# EAGLE design Qwiic-Bluetooth-HC1X (EAGLE 9.0.1)
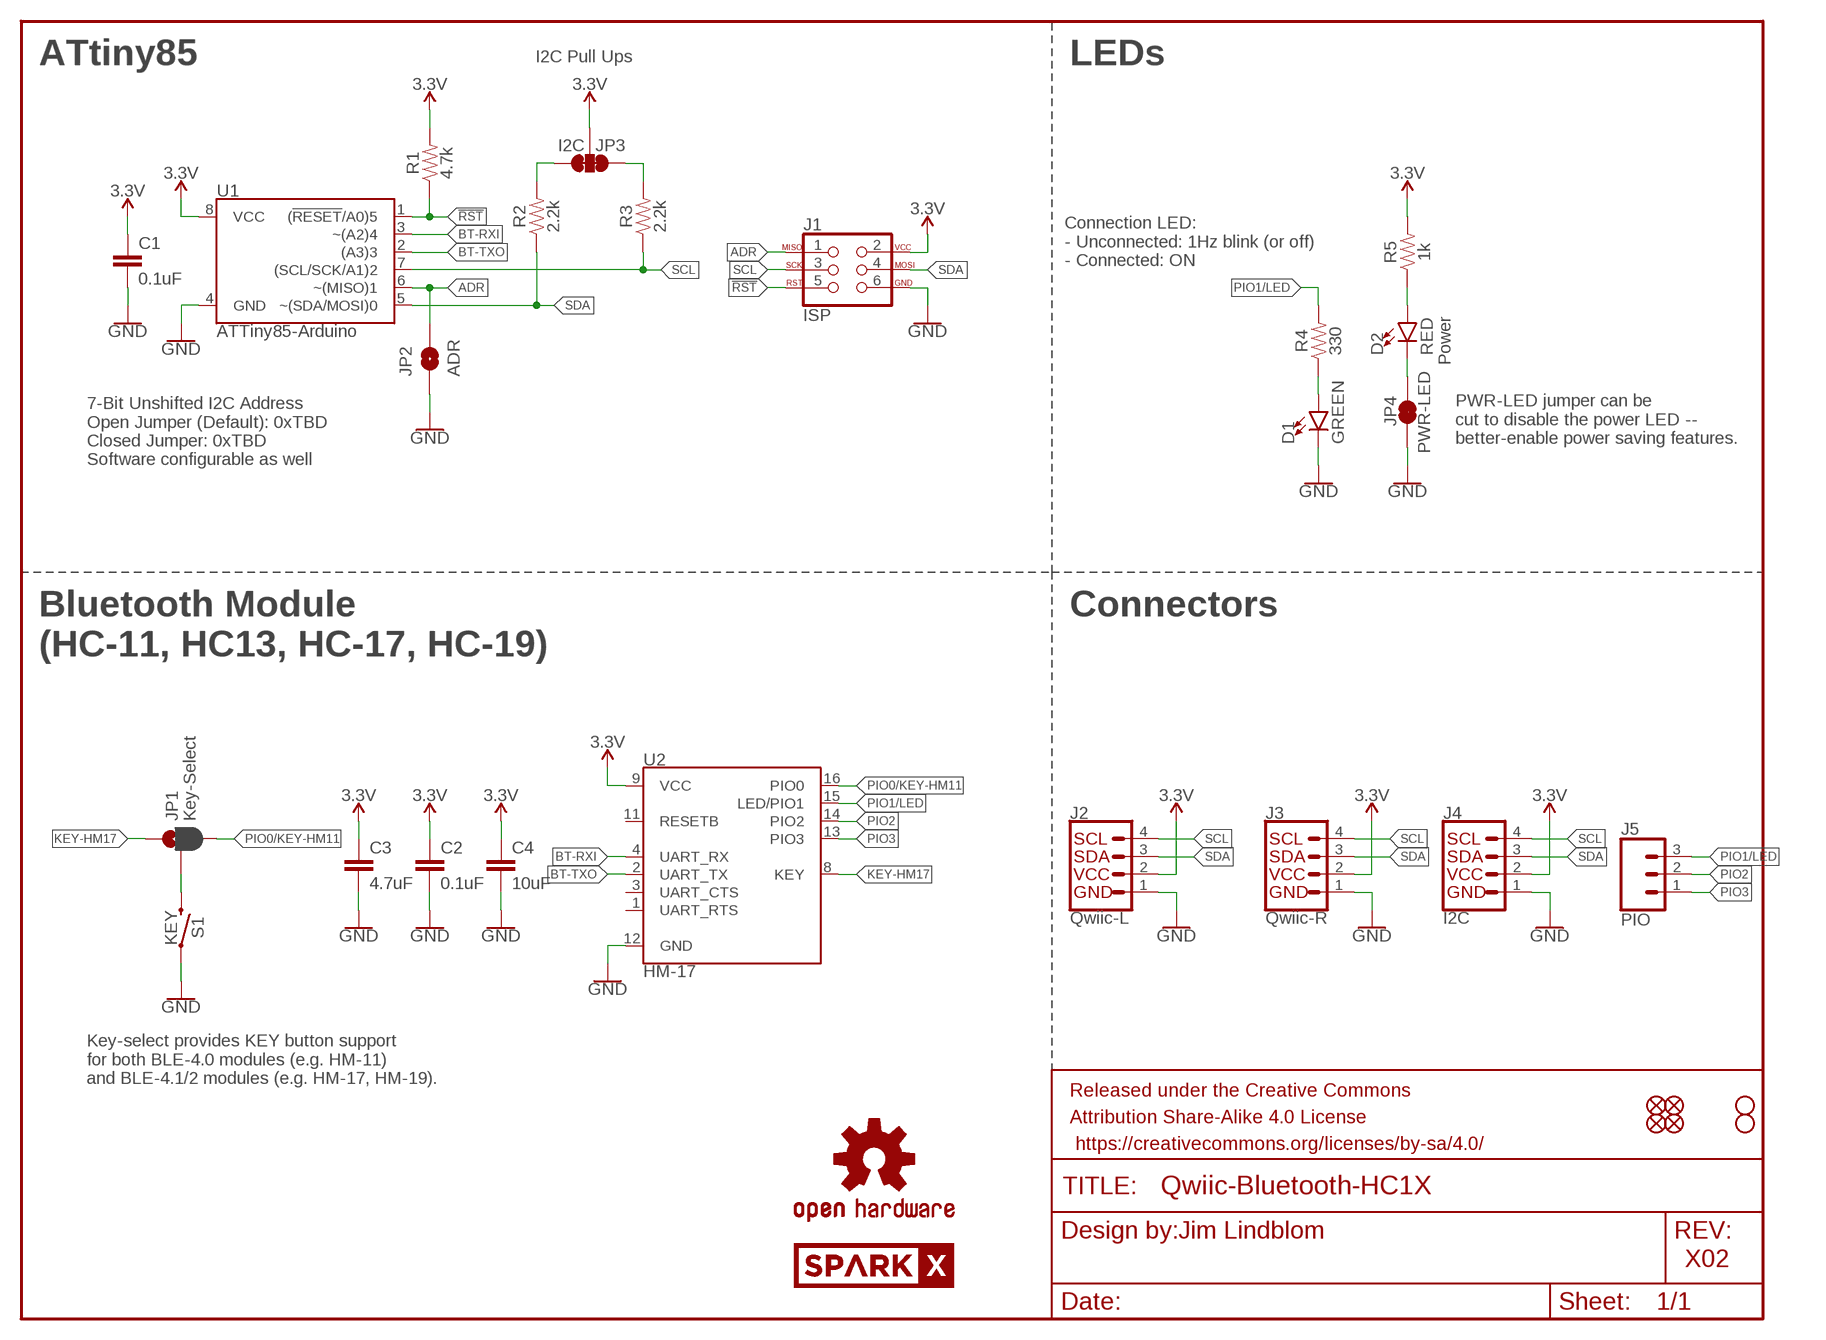
[diagram p0: schematic, sheet 1]

## Parts
C1  0.1uF  0.1UF-0603-25V-(+80/-20%)  [0603]
C2  0.1uF  0.1UF-0603-25V-(+80/-20%)  [0603]
C3  4.7uF  4.7UF-0603-6.3V-(10%)  [0603]
C4  10uF  10UF-0603-6.3V-20%  [0603]
D1  GREEN  LED-GREEN0603  [LED-0603]
D2  RED  LED-RED0603  [LED-0603]
FRAME1  FRAME-LETTER  [CREATIVE_COMMONS]
J1  ISP  AVR_SPI_PROG_3X2TESTPOINTS  [2X3_TEST_POINTS]
J2  Qwiic-L  QWIIC_CONNECTORJS-1MM  [1X04_1MM_RA]
J3  Qwiic-R  QWIIC_CONNECTORJS-1MM  [1X04_1MM_RA]
J4  I2C  I2C_STANDARD_NO_SILK  [1X04_NO_SILK]
J5  PIO  CONN_031X03_NO_SILK  [1X03_NO_SILK]
JP1  Key-Select  JUMPER-SMT_3_1-NC_PASTE_NO-SILK  [SMT-JUMPER_3_1-NC_PASTE_NO-SILK]
JP2  ADR  JUMPER-SMT_2_NO_NO-SILK  [SMT-JUMPER_2_NO_NO-SILK]
JP3  I2C  JUMPER-SMT_3_2-NC_TRACE_NO-SILK  [SMT-JUMPER_3_2-NC_TRACE_NO-SILK]
JP4  PWR-LED  JUMPER-SMT_2_NC_TRACE_NO-SILK  [SMT-JUMPER_2_NC_TRACE_NO-SILK]
JP5  FIDUCIALUFIDUCIAL  [FIDUCIAL-MICRO]
JP6  FIDUCIALUFIDUCIAL  [FIDUCIAL-MICRO]
JP7  FIDUCIALUFIDUCIAL  [FIDUCIAL-MICRO]
JP8  FIDUCIALUFIDUCIAL  [FIDUCIAL-MICRO]
JP11  STAND-OFF  [STAND-OFF]
JP12  STAND-OFF  [STAND-OFF]
LOGO1  OSHW-LOGOMINI  [OSHW-LOGO-MINI]
LOGO2  SPARKX-LOGO4  [SPARKX-MEDIUM]
LOGO3  SPARKX-LOGO4  [SPARKX-MEDIUM]
R1  4.7k  4.7KOHM-0603-1/10W-1%  [0603]
R2  2.2k  2.2KOHM-0603-1/10W-1%  [0603]
R3  2.2k  2.2KOHM-0603-1/10W-1%  [0603]
R4  330  330OHM-0603-1/10W-1%  [0603]
R5  1k  1KOHM-0603-1/10W-1%  [0603]
S1  KEY  MOMENTARY-SWITCH-SPST-SMD-4.6X2.8MM  [TACTILE_SWITCH_SMD_4.6X2.8MM]
U1  ATTiny85-Arduino  ATTINY85-ARDUINOTINY85-20-SMT  [SO08-EIAJ_MCU]
U2  HM-17  [HM-11]

## Nets
3.3V: C1.1 C2.1 C3.1 C4.1 J1.2 J2.2 J3.2 J4.2(VCC) JP3.2 R1.2 R5.2 U1.8(VCC) U2.9(VCC)
!RST: J1.5 R1.1 U1.1((!RESET!/A0)5)
ADR: J1.1 JP2.2 U1.6(~(MISO)1)
BT-RXI: U1.3(~(A2)4) U2.4(UART_RX)
BT-TXO: U1.2((A3)3) U2.2(UART_TX)
GND: C1.2 C2.2 C3.2 C4.2 D1.C J1.6 J2.1 J3.1 J4.1(GND) JP2.1 JP4.1 S1.1 S1.2 U1.4(GND) U2.12(GND)
KEY-HM17: JP1.1 U2.8(KEY)
N$1: D2.C JP4.2
N$2: D1.A R4.1
N$3: D2.A R5.1
N$4: JP1.2 S1.3 S1.4
PIO0/KEY-HM11: JP1.3 U2.16(PIO0)
PIO1/LED: J5.3 R4.2 U2.15(LED/PIO1)
PIO2: J5.2 U2.14(PIO2)
PIO3: J5.1 U2.13(PIO3)
SCL: J1.3 J2.4 J3.4 J4.4(SCL) R3.1 U1.7((SCL/SCK/A1)2)
SCL_PU1: JP3.1 R3.2
SDA: J1.4 J2.3 J3.3 J4.3(SDA) R2.1 U1.5(~(SDA/MOSI)0)
SDA_PU1: JP3.3 R2.2
Unconnected: U2.1(UART_RTS) U2.3(UART_CTS) U2.11(RESETB)

## Notes on the sheet
- ATtiny85 | LEDs
- I2C Pull Ups
- Connection LED:
  - Unconnected: 1Hz blink (or off)
  - Connected: ON
- Power
- PWR-LED jumper can be 
  cut to disable the power LED -- 
  better-enable power saving features.
- 7-Bit Unshifted I2C Address
  Open Jumper (Default): 0xTBD
  Closed Jumper: 0xTBD
  Software configurable as well
- Bluetooth Module
  (HC-11, HC13, HC-17, HC-19)
- Connectors
- Key-select provides KEY button support 
  for both BLE-4.0 modules (e.g. HM-11) 
  and BLE-4.1/2 modules (e.g. HM-17, HM-19).
- Jim Lindblom
- X02

## Library data of the parts
C1 C2 = SparkFun-Capacitors:0.1UF: 0.1µF ceramic capacitors A capacitor is a passive two-terminal electrical component used to store electrical energy temporarily in an electric field.; PROD_ID: CAP-00810
C3 = SparkFun-Capacitors:4.7UF: 4.7µF ceramic capacitors A capacitor is a passive two-terminal electrical component used to store electrical energy temporarily in an electric field.; PROD_ID: CAP-08280
C4 = SparkFun-Capacitors:10UF: 10.0µF ceramic capacitors A capacitor is a passive two-terminal electrical component used to store electrical energy temporarily in an electric field.; PROD_ID: CAP-11015
D1 = SparkFun-LED:LED-GREEN: Green SMD LED Used in manufacturing of various products at SparkFun Packages: 0603 - SMD 0603 package [Product Link] <http://www.futureelectronics.com/en/technologies/semiconductors/optoelectronics/leds/Pages/9894312-LTST-C190GKT.aspx?CrossPart=HSMG-C190&IM=0> LilyPad 1206 - SMD1206 LilyPad package [Product Link] <http://www.futureelectronics.com/en/Technologies/Product.aspx?ProductID=IN150NGHARVATEKCORPORATION2049943&IM=0> 1206 - SMD1206 package [Product Link] <http://www.futureelectronics.com/en/technologies/semiconductors/optoelectronics/leds/Pages/8315665-LTST-C150KGKT.aspx?IM=0> 1206 Bottom Mount -SMD 1206 Bottom Mount [Product Link] <http://www.digikey.com/product-detail/en/lite-on-inc/LTST-C230KGKT/160-1456-1-ND/386854> SparkFun Products: Pro Mini 328 -5V <https://www.sparkfun.com/products/821> RedBoard <https://www.sparkfun.com/products/12757> MP3 Trigger <https://www.sparkfun.com/products/13720> Makey Makey <https://www.sparkfun.com/products/11076>; PROD_ID: DIO-00821
D2 = SparkFun-LED:LED-RED: Red SMD LED Used in manufacturing of most products at SparkFun Packages: 0603 - SMD 0603 package [Product Link] <http://docs.avagotech.com/docs/AV02-0551EN> 0603 SMART - SMD 0603 SMART package ( more efficient and expensive)[Product Link] <http://www.osram-os.com/Graphics/XPic2/00077099_0.pdf> 1206 - SMD1206 package [Product Link] <https://www.sparkfun.com/datasheets/DevTools/LilyPad/Q150OVS4.pdff> SparkFun Products: Pro Mini 328 -5V <https://www.sparkfun.com/products/821> RedBoard <https://www.sparkfun.com/products/12757> IOIO-OTG <https://www.sparkfun.com/products/13613>; PROD_ID: DIO-00819
FRAME1 = SparkFun-Aesthetics:FRAME-LETTER: Schematic Frame - Letter Standard 8.5x11 US Letter frame
J1 = SparkFun-Connectors:AVR_SPI_PROG_3X2: AVR ISP 6 Pin This is the reduced ISP connector for AVR programming. Common on Arduino. This footprint will take up less PCB space and can be used with a 10-pin to 6-pin adapter such as SKU: BOB-08508 **Special note about "TEST_POINT" package. The stop mask is on the top side, so if you want your programming test points to be on the bottom of your board, make sure to place this package on the bottom side of the board. This also ensure that the orientation to program from the bottom side will be correct. SparkFun Products: SparkFun ISP Pogo Adapter <https://www.sparkfun.com/products/11591> - NS Tiny AVR Programmer <https://www.sparkfun.com/products/11801> -PTH
J2 J3 = SparkFun-Connectors:QWIIC_CONNECTOR: SparkFun I2C Standard Qwiic Connector An SMD 1mm pitch JST connector makes it easy and quick (get it? Qwiic?) to connect I2C devices to each other. The Qwiic system <http://www.sparkfun.com/qwiic> enables fast and solderless connection between popular platforms and various sensors and actuators. We carry 200mm <https://www.sparkfun.com/products/14204>, 100mm <https://www.sparkfun.com/products/14205>, 50mm <https://www.sparkfun.com/products/14206>, and breadboard friendly <https://www.sparkfun.com/products/14207> Qwiic cables. We also offer 10 pcs strips <https://www.sparkfun.com/products/14323> the SMD connectors.; PROD_ID: CONN-13694
J4 = SparkX:I2C_STANDARD: SparkFun I2C Standard Pinout Header SparkFun has standardized on a pinout for all I2C based sensor breakouts. This pinout allows I2C boards to be plugged directly into the headers on Arduino Uno compatible boards, and to be daisy chained easily. Example SparkFun Products: SparkFun Atmospheric Sensor Breakout - BME280 <https://www.sparkfun.com/products/13676> SparkFun Altitude/Pressure Sensor Breakout - MPL3115A2 <https://www.sparkfun.com/products/11084> SparkFun TOF Range Finder Sensor - VL6180 <https://www.sparkfun.com/products/12785>
J5 = SparkFun-Connectors:CONN_03: Multi connection point. Often used as Generic Header-pin footprint for 0.1 inch spaced/style header connections On any of the 0.1 inch spaced packages, you can populate with these: Break Away Headers - Straight <https://www.sparkfun.com/products/116> (PRT-00116) Break Away Male Headers - Right Angle <https://www.sparkfun.com/products/553> (PRT-00553) Female Headers <https://www.sparkfun.com/products/115> (PRT-00115) Break Away Headers - Machine Pin <https://www.sparkfun.com/products/117> (PRT-00117) Break Away Female Headers - Swiss Machine Pin <https://www.sparkfun.com/products/743> (PRT-00743) Stackable Header - 3 Pin (Female, 0.1") <https://www.sparkfun.com/products/13875> (PRT-13875) For SCREWTERMINALS and SPRING TERMINALS visit here: Screw Terimnals on SparkFun.com <https://www.sparkfun.com/search/results?term=Screw+Terminals> (5mm/3.5mm/2.54mm spacing) This device is also useful as a general connection point to wire up your design to another part of your project. Our various solder wires solder well into these plated through hole pads. Hook-Up Wire - Assortment (Stranded, 22 AWG) <https://www.sparkfun.com/products/11375> (PRT-11375) Hook-Up Wire - Assortment (Solid Core, 22 AWG) <https://www.sparkfun.com/products/11367> (PRT-11367) View the entire wire category on our website here <https://www.sparkfun.com/categories/141> Special notes: Molex polarized connector foot print use with SKU : PRT-08232 with associated crimp pins and housings.
JP1 = SparkFun-Jumpers:JUMPER-SMT_3_1-NC_PASTE: Normally closed solder jumper (1 of 2 connections) This jumper has an aperture in the stencil to allow solder paste to bridge one of the two connections. One connection is normally closed (NC), while the other is normally open (NO). Wick off the solder to open the connection. Reapply solder to reclose the connection. Apply solder to the other side instead to change the current path.
JP2 = SparkFun-Jumpers:JUMPER-SMT_2_NO: Normally open jumper This jumper has two pads in close proximity to each other. Apply solder to close the connection. Round pads are easier to solder for beginners, but are a lot larger. SparkFun Product that uses the round pads: SparkFun EL Sequencer <https://www.sparkfun.com/products/12781>
JP3 = SparkFun-Jumpers:JUMPER-SMT_3_2-NC_TRACE: Normally closed trace jumper (2 of 2 connections) This jumper has a trace between all three pads so they are normally closed (NC). Use a razor knife to open the connection(s). For best results follow the IPC guidelines for cutting traces: Cutout at least 0.063 mm (0.005 in). Remove all loose material to clean up the cut area. Seal the cut with an approved epoxy. Reapply solder to reclose the connection(s).
JP4 = SparkFun-Jumpers:JUMPER-SMT_2_NC_TRACE: Normally closed trace jumper This jumper has a trace between two pads so it's normally closed (NC). Use a razor knife to open the connection. For best results follow the IPC guidelines for cutting traces: Cutout at least 0.063 mm (0.005 in). Remove all loose material to clean up the cut area. Seal the cut with an approved epoxy. Reapply solder to reclose the connection.
JP5-JP8 = SparkFun-Aesthetics:FIDUCIAL: Fiducial Alignment Points Point-of-reference for pick-and-place machines and other optical instruments.
JP11 JP12 = SparkFun-Hardware:STAND-OFF: Stand Off Drill holes for mechanically mounting via screws, standoffs, etc. Note: Use the keepout ring to avoid running the screw head into surrounding components. Variant Overviews STAND-OFF - Mechanical footprint for a #4 phillips button head screw. STAND-OFF-TIGHT - Mechanical footprint for a #4 phillips button head screw, Example SparkFun Products Screw - Phillips Head (1/4", 4-40, 10 pack) <https://www.sparkfun.com/products/10453> (PRT-10453) Screw - Phillips Head (1/2", 4-40, 10 pack) <https://www.sparkfun.com/products/10452> (PRT-10452) Screw - Phillips Head (3/4", 4-40, 10 pack) <https://www.sparkfun.com/products/10451> (PRT-10451) Screw - Phillips Head (1", 4-40, 10 pack) <https://www.sparkfun.com/products/10450> (PRT-10450)
LOGO1 = SparkFun-Aesthetics:OSHW-LOGO: Open-Source Hardware (OSHW) Logo This logo indicates the piece of hardware it is found on incorporates a OSHW license and/or adheres to the definition of open source hardware found here: http://freedomdefined.org/OSHW
LOGO2 LOGO3 = SparkX:SPARKX-LOGO
R1 = SparkFun-Resistors:4.7KOHM: 4.7kΩ resistor A resistor is a passive two-terminal electrical component that implements electrical resistance as a circuit element. Resistors act to reduce current flow, and, at the same time, act to lower voltage levels within circuits. - Wikipedia; PROD_ID: RES-07857
R2 R3 = SparkFun-Resistors:2.2KOHM: 2.2kΩ resistor A resistor is a passive two-terminal electrical component that implements electrical resistance as a circuit element. Resistors act to reduce current flow, and, at the same time, act to lower voltage levels within circuits. - Wikipedia; PROD_ID: RES-08272
R4 = SparkFun-Resistors:330OHM: 330Ω resistor A resistor is a passive two-terminal electrical component that implements electrical resistance as a circuit element. Resistors act to reduce current flow, and, at the same time, act to lower voltage levels within circuits. - Wikipedia; PROD_ID: RES-00818
R5 = SparkFun-Resistors:1KOHM: 1kΩ resistor A resistor is a passive two-terminal electrical component that implements electrical resistance as a circuit element. Resistors act to reduce current flow, and, at the same time, act to lower voltage levels within circuits. - Wikipedia; PROD_ID: RES-07856
S1 = SparkFun-Switches:MOMENTARY-SWITCH-SPST: Momentary Switch (Pushbutton) - SPST Normally-open (NO) SPST momentary switches (buttons, pushbuttons). Variants PTH-12MM - 12mm square, through-hole Momentary Pushbutton Switch - 12mm Square <https://www.sparkfun.com/products/9190> (COM-09190) PTH-6.0MM, PTH-6.0MM-KIT - 6.0mm square, through-hole Mini Pushbutton Switch <https://www.sparkfun.com/products/97> (COM-00097) KIT package intended for soldering kit's - only one side of pads' copper is exposed. PTH-RIGHT-ANGLE-KIT - Right-angle, through-hole Right Angle Tactile Button <https://www.sparkfun.com/products/10791> - Used on SparkFun BigTime Watch Kit <https://www.sparkfun.com/products/11734> SMD-12MM - 12mm square, surface-mount Tactile Button - SMD (12mm) <https://www.sparkfun.com/products/12993> (COM-12993) Used on SparkFun PicoBoard <https://www.sparkfun.com/products/11888> SMD-4.5MM - 4.5mm Square Trackball Switch Used on SparkFun Blackberry Trackballer Breakout <https://www.sparkfun.com/products/13169> SMD-4.6MMX2.8MM - 4.60mm x 2.80mm, surface mount Used on SparkFun SAMD21 Mini Breakout <https://www.sparkfun.com/products/13664> SMD-5.2MM, SMD-5.2-REDUNDANT - 5.2mm square, surface-mount Mini Pushbutton Switch - SMD <https://www.sparkfun.com/products/8720> (COM-08720) Used on Arduino Pro Mini <https://www.sparkfun.com/products/11114> REDUNDANT package connects both switch circuits together SMD-6.0X3.5MM - 6.0 x 3.5mm, surface mount Momentary Reset Switch SMD <https://www.sparkfun.com/products/8229> (COM-08229) SMD-6.2MM-TALL - 6.2mm square, surface mount Tactile Button - SMD (6mm) <https://www.sparkfun.com/products/12992> Used on SparkFun Digital Sandbox <https://www.sparkfun.com/products/12651> SMD-RIGHT-ANGLE - Right-angle, surface mount Used on SparkFun Block for Intel® Edison - Arduino <https://www.sparkfun.com/products/13036>; PROD_ID: SWCH-13065
U1 = Qwiic-Bluetooth-HC1x:ATTINY85-ARDUINO: Atmel 8-pin 2/4/8kB flash uC; PROD_ID: IC-09092; VALUE: Tiny85-20-SMT
U2 = Qwiic-Bluetooth-HC1x:HM-17

## Board
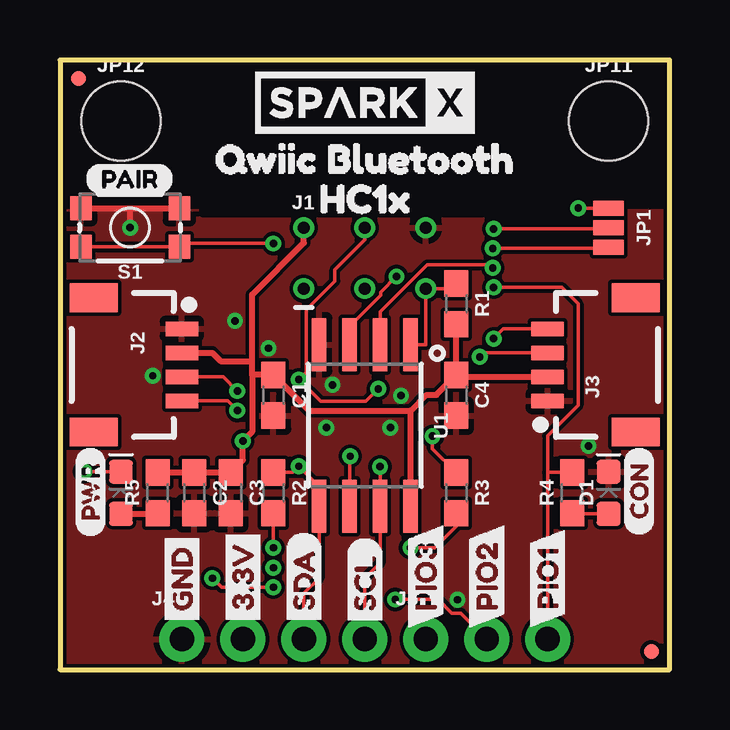
[diagram p1: board, top side]
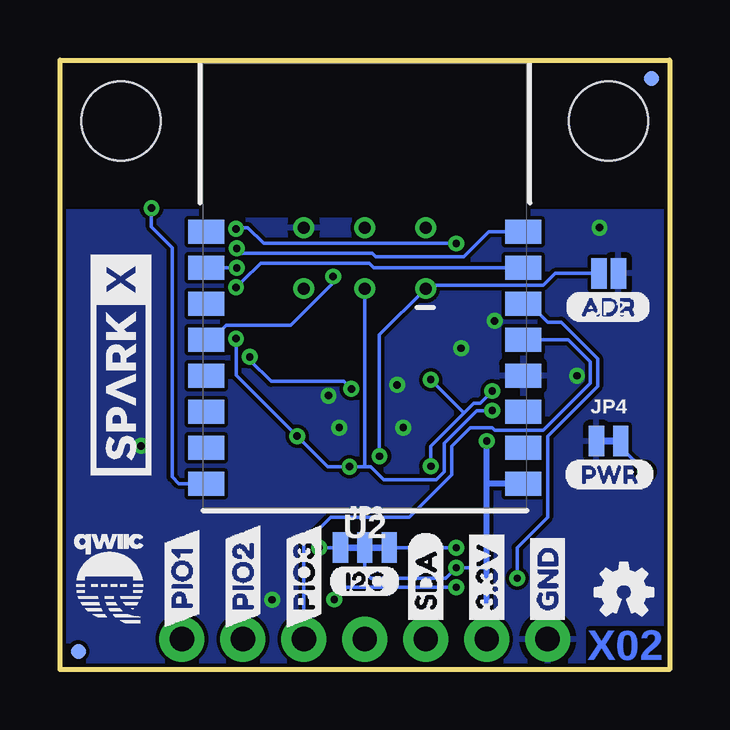
[diagram p2: board, bottom side, seen from below]

Size 25.4 x 25.4 mm. Coordinates in mm from the lower left corner, seen from the top.
Outline: 0,0 25.4,0 25.4,25.4 0,25.4 0,0
Copper layers (1*16): Top 0.035mm / dielectric 1.5mm / Bottom 0.035mm
Design rules "SparkFun-2-layer-PCBWay-LIMIT": minimum track width 6mil, minimum drill 0.3mm, track to track 6mil, track to pad 6mil, pad to pad 6mil, via to via 6mil, smd to smd 6mil, copper to edge 6mil, drill to drill 6mil, minimum pad ring 7mil, minimum via ring 7mil, stop-mask expansion 4mil, vias tented up to drill 25mil, thermal gap 10mil

### Footprints (pad centres in the part's own frame; a part is rotated, then mirrored left to right if it is on the bottom)
0603 = smd 1.1 x 1: 1 -0.85,0; 2 0.85,0
LED-0603 = smd 1 x 1: A -0.877,0; C 0.877,0
2X3_TEST_POINTS = drill 0.508: 1 -2.54,-1.27; 2 -2.54,1.27; 3 0,-1.27; 4 0,1.27; 5 2.54,-1.27; 6 2.54,1.27
1X04_1MM_RA = smd 0.6 x 1.35: 1 -1.5,0; 2 -0.5,0; 3 0.5,0; 4 1.5,0 | smd 1.2 x 2: NC1 2.8,-3.675; NC2 -2.8,-3.675
1X04_NO_SILK = drill 1.016 pad 1.88: 1 0,0; 2 2.54,0; 3 5.08,0; 4 7.62,0
1X03_NO_SILK = drill 1.016 pad 1.88: 1 0,0; 2 2.54,0; 3 5.08,0
SMT-JUMPER_3_1-NC_PASTE_NO-SILK = smd 0.635 x 1.27: 1 -0.813,0; 2 0,0; 3 0.813,0
SMT-JUMPER_2_NO_NO-SILK = smd 0.635 x 1.27: 1 -0.406,0; 2 0.406,0
SMT-JUMPER_3_2-NC_TRACE_NO-SILK = smd 0.635 x 1.27: 1 -1.016,0; 2 0,0; 3 1.016,0
SMT-JUMPER_2_NC_TRACE_NO-SILK = smd 0.635 x 1.27: 1 -0.508,0; 2 0.508,0
FIDUCIAL-MICRO = smd 0.635 x 0.635: 1 0,0
STAND-OFF = hole 3.302: 0,0
TACTILE_SWITCH_SMD_4.6X2.8MM = smd 0.9 x 1: 1 -2.05,-0.8; 2 2.05,-0.8; 3 2.05,0.8; 4 -2.05,0.8
SO08-EIAJ_MCU = smd 0.61 x 2.21: 1 -1.905,-3.378; 2 -0.635,-3.378; 3 0.635,-3.378; 4 1.905,-3.378; 5 1.905,3.353; 6 0.635,3.353; 7 -0.635,3.353; 8 -1.905,3.353
HM-11 = smd 1.5 x 1: 1 -6.6,2.25; 2 -6.6,0.75; 3 -6.6,-0.75; 4 -6.6,-2.25; 5 -6.6,-3.75; 6 -6.6,-5.25; 7 -6.6,-6.75; 8 -6.6,-8.25; 9 6.6,-8.25; 10 6.6,-6.75; 11 6.6,-5.25; 12 6.6,-3.75; 13 6.6,-2.25; 14 6.6,-0.75; 15 6.6,0.75; 16 6.6,2.25

### Placement (x,y rotation side)
C1  8.89,11.43 270 top
C2  5.59,7.37 270 top
C3  7.11,7.37 270 top
C4  16.51,11.43 270 top
D1  22.86,7.37 90 top
D2  2.54,7.37 90 top
FRAME1  1.27,-8.89 0 top  (outside the outline)
J1  12.7,17.14 0 top
J2  5.08,12.7 270 top
J3  20.32,12.7 90 top
J4  5.08,1.27 0 top
J5  15.24,1.27 0 top
JP1  22.86,18.41 270 top
JP2  2.54,16.51 180 bottom
JP3  12.7,5.08 0 bottom
JP4  2.54,9.53 0 bottom
JP5  24.64,0.76 0 bottom
JP6  24.64,0.76 0 top
JP7  0.76,24.64 0 top
JP8  0.76,24.64 0 bottom
JP11  22.86,22.86 0 top
JP12  2.54,22.86 0 top
LOGO1  1.91,3.24 0 bottom
LOGO2  22.86,12.7 90 bottom
LOGO3  12.7,23.62 0 top
R1  16.51,15.24 270 top
R2  8.89,7.37 270 top
R3  16.51,7.37 270 top
R4  21.34,7.37 90 top
R5  4.06,7.37 90 top
S1  2.92,18.41 180 top
U1  12.7,10.16 180 top
U2  12.7,16 0 bottom
U$1  [SDA4]  10.16,1.65 90 bottom
U$2  [HC1X12]  9.78,19.62 0 top
U$3  [PIO110]  20.32,1.71 90 top
U$4  [GND0]  5.08,1.65 90 top
U$5  [3#3V1]  7.62,1.65 90 top
U$6  [SDA4]  10.16,1.65 90 top
U$7  [SCL2]  12.7,1.46 90 top
U$8  [PIO33]  15.24,1.65 90 top
U$9  [PIO29]  17.78,1.65 90 top
U$10  [GND0]  5.08,1.65 90 bottom
U$11  [3#3V1]  7.62,1.65 90 bottom
U$13  [PWR5]  4.38,8.13 0 bottom
U$14  [PIO33]  15.24,1.65 90 bottom
U$15  [PIO29]  17.78,1.65 90 bottom
U$16  [PWR5]  1.27,5.52 90 top
U$17  [CON13]  24.13,5.59 90 top
U$18  [QWIIC_BLUETOOTH11]  5.46,21.27 0 top
U$19  [ADR8]  4.38,15.11 0 bottom
U$20  [I2C7]  14.22,3.68 0 bottom
U$21  [QWIIC-LOGO-SMALL]  23.43,3.75 0 bottom
U$22  [PIO110]  20.32,1.71 90 bottom
U$23  [PAIR15]  1.02,20.45 0 top

### Tracks (layer width: path | path; a pad name or v marks a point on that pad's centre or on a via)
3.3V  (via drill 0.3)
  Top 0.254: 14.61,10.79 10.38,10.79 C1.1 8,12.28 | U1.8 14.61,10.79 | J2.2 6.35,13.2 6.7,12.85 8,12.85 | 14.61,10.79 15.26,11.45 15.68,11.45 C4.1 | C4.1 16.59,12.2 J3.2 | C4.1 R1.2 | 8,12.28 8,9.91 v7.62,9.53 7.62,8.72 C3.1 C2.1 R5.2 | J1.2 10.16,17.78 8,15.62 8,12.85 | 8,12.28 8,12.85
  Bottom 0.152: 12.62,4.74 12.62,5 JP3.2 12.7,4.06 12.45,3.81 9.32,3.81 v8.89,4.24 7.62,4.24 7.62,3.81
  Bottom 0.254: J4.2 7.62,3.81 7.62,7.75 | 7.62,7.75 v7.62,9.53 | U2.9 7.62,7.75
!RST
  Top 0.152: U1.1 15.24,13.54 J1.5 16.3,15.88 R1.1
ADR  (via drill 0.3)
  Top 0.152: U1.6 12.06,8.87 v12.09,8.89
  Bottom 0.152: v12.09,8.89 12.09,13.95 J1.1 10.01,16.02 5.25,16.02 4.77,16.51 JP2.2
BT-RXI  (via drill 0.3)
  Top 0.152: v14.02,16.38 13.36,15.72 13.36,15.6 12.06,14.31 U1.3
  Bottom 0.152: U2.4 19.07,13.75 18.47,14.35 15.8,14.35 14.02,16.13 v14.02,16.38
BT-TXO  (via drill 0.3)
  Top 0.152: U1.2 13.34,14.9 15.3,16.87 17.9,16.87 v18.03,16.74
  Bottom 0.152: v18.03,16.74 19.29,16.74 U2.2
GND  (via drill 0.3)
  Top 0.254: S1.2 2.92,19.21 | 2.92,19.21 S1.1 | v2.92,18.41 2.92,19.21
  other vias: 16.56,2.91 11.35,11.86 11.1,10.08 13.77,10.08 14.21,11.42 3.86,12.24 7.29,14.53 8.69,13.39 22.02,9.32
  pour Top (isolate 0.152): 0,19.05 0,0 25.4,0 25.4,19.05
  pour Bottom (isolate 0.152): 25.4,19.05 25.4,0 0,0 0,19.05
KEY-HM17  (via drill 0.3)
  Top 0.152: v21.59,19.23 JP1.1
  Bottom 0.152: v21.59,19.23 21.59,18.44 20.73,17.58 20.73,8.03 20.45,7.75 U2.8
N$1  (via drill 0.3)
  Top 0.152: D2.C 1.03,8.24 v1.02,8.26
  Bottom 0.152: JP4.2 2.03,9.27 v1.02,8.26
N$2
  Top 0.152: R4.1 21.34,6.49 D1.A
N$3
  Top 0.254: D2.A 4.04,6.49 R5.1
N$4  (via drill 0.3)
  Top 0.152: S1.3 S1.4 5.11,17.75 v8.89,17.75 | v18.07,18.36 22.81,18.36 JP1.2
  Bottom 0.152: v8.89,17.75 16.91,17.75 17.57,18.41 18.02,18.41 v18.07,18.36
PIO0/KEY-HM11  (via drill 0.3)
  Top 0.152: v18.03,17.55 22.81,17.55 JP1.3
  Bottom 0.152: U2.16 7.53,18.25 8.59,17.2 12.24,17.2 12.39,17.35 17.83,17.35 v18.03,17.55
PIO1/LED  (via drill 0.3)
  Top 0.152: v18.07,15.93 20.9,15.93 21.59,15.24 21.59,11.01 20.32,9.74 20.32,8.22 | 20.32,8.22 J5.3 | R4.2 20.32,8.22
  Bottom 0.152: v18.07,15.93 17.81,16.18 17.8,16.18 17.04,16.94 12.52,16.94 12.34,16.75 U2.15
PIO2  (via drill 0.3)
  Top 0.152: v6.35,3.81 6.73,3.43 v8.89,3.43 | J5.2 16.7,2.35 16.33,2.35 15.76,2.92 v13.97,2.92
  Bottom 0.152: v6.35,3.81 6.35,5.08 5.08,6.35 5.08,9.73 3,11.81 3,12.95 4.53,14.48 5.08,14.48 5.85,15.25 U2.14 | v8.89,3.43 13.46,3.43 v13.97,2.92
PIO3
  Bottom 0.152: U2.13 4.23,13.75 3.3,12.83 3.3,11.94 5.26,9.98 7.29,9.98 7.39,10.08 8.31,10.08 9.08,9.31 9.08,8.11 10.84,6.35 14.12,6.35 15.24,5.24 J5.1
SCL  (via drill 0.3)
  Top 0.152: v13.34,8.46 U1.7 13.34,4.45 12.7,3.81 J4.4 | v18.07,13.79 18.48,14.2 J3.4 | R3.1 15.52,9.21 v15.52,9.73 | v7.39,10.79 6.99,11.2 J2.4
  Bottom 0.152: 12.7,8.46 12.45,8.46 11.9,7.91 9.71,7.91 9.39,8.24 9.39,9.44 8.03,10.79 v7.39,10.79 | 12.7,8.46 v13.34,8.46 14.25,8.46 v15.52,9.73 18.05,12.26 18.05,13.78 v18.07,13.79 | J1.3 12.7,8.46
SCL_PU1  (via drill 0.3)
  Top 0.152: v14.61,5.08 15.62,5.08 16.51,5.97 R3.2
  Bottom 0.152: JP3.1 v14.61,5.08
SDA  (via drill 0.3)
  Top 0.152: U1.5 10.79,6 | U1.5 10.79,7.62 v9.95,8.47 9.69,8.22 R2.1 | v9.95,12.08 | v9.95,12.08 10.08,11.95 | v9.95,12.08 10.86,11.18 12.74,11.18 v13.26,11.7 | J1.4 12.7,17.91 11.46,16.66 11.46,16.18 10.26,14.99 10.26,12.39 v9.95,12.08 | J4.3 10.16,3.17 10.79,3.81 U1.5 | v17.49,13.03 17.66,13.2 J3.3 | J2.3 6.8,12.2 v7.39,11.61
  Bottom 0.152: v13.26,11.7 13.57,12.01 16.6,12.01 17.49,12.89 v17.49,13.03 | v9.95,8.47 9.95,9.31 8.55,10.71 | v7.39,11.61 7.9,11.1 8.15,11.1 8.55,10.71 | v9.95,12.08 8.57,10.71 8.55,10.71
SDA_PU1  (via drill 0.3)
  Top 0.152: R2.2 v8.89,5.08
  Bottom 0.152: JP3.3 v8.89,5.08

### Text on the board
Bottom: X02
tDocu: Jim Lindblom